# Altium schematic sheet X13-Isolation.SchDoc
size A4; SheetNumber: 24
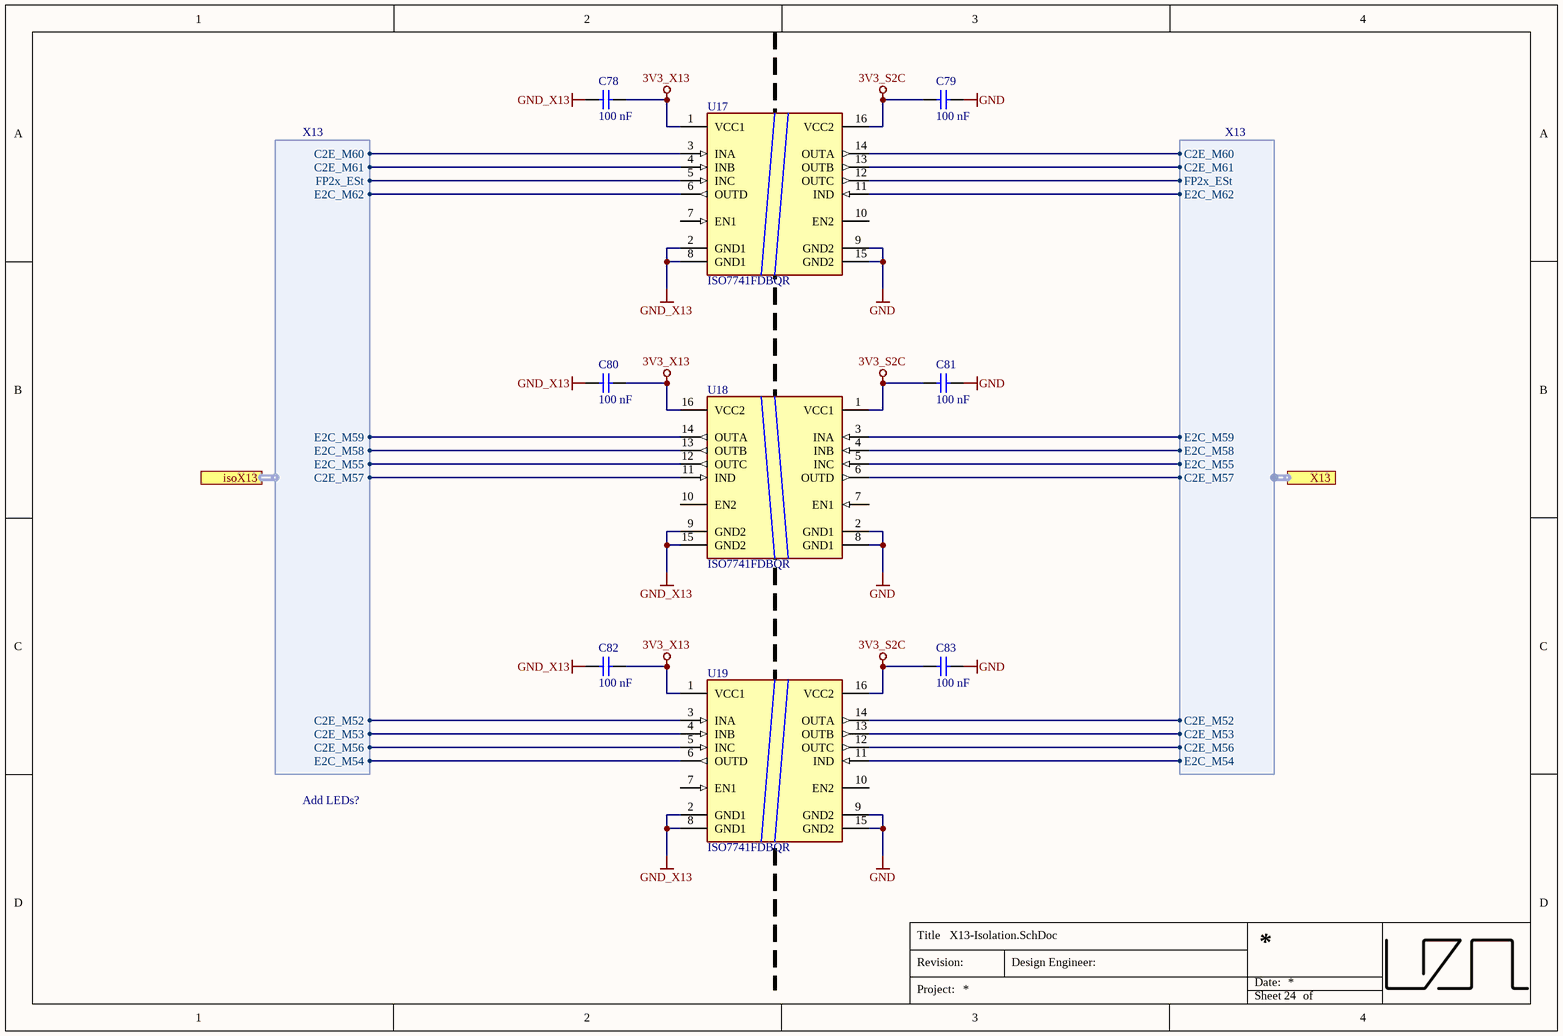
[diagram p0: X13-Isolation.SchDoc]

## Parts
C78  100 nF  [C_0603_TE]
C79  100 nF  [C_0603_TE]
C80  100 nF  [C_0603_TE]
C81  100 nF  [C_0603_TE]
C82  100 nF  [C_0603_TE]
C83  100 nF  [C_0603_TE]
U17  ISO7741FDBQR  [SOP64P600X175-16N]
U18  ISO7741FDBQR  [SOP64P600X175-16N]
U19  ISO7741FDBQR  [SOP64P600X175-16N]

## Ports
isoX13 (harness X13), X13 (harness X13)

## Harnesses
X13: C2E_M52, C2E_M53, C2E_M56, C2E_M57, C2E_M60, C2E_M61, E2C_M54, E2C_M55, E2C_M58, E2C_M59, E2C_M62, FP2x_ESt

## Nets
3V3_S2C: C79.2 C81.2 C83.2 U17.16(VCC2) U18.1(VCC1) U19.16(VCC2)
3V3_X13: C78.1 C80.1 C82.1 U17.1(VCC1) U18.16(VCC2) U19.1(VCC1)
GND: C79.1 C81.1 C83.1 U17.9(GND2) U17.15(GND2) U18.2(GND1) U18.8(GND1) U19.9(GND2) U19.15(GND2)
GND_X13: C78.2 C80.2 C82.2 U17.2(GND1) U17.8(GND1) U18.9(GND2) U18.15(GND2) U19.2(GND1) U19.8(GND1)
NetU17_3: U17.3(INA) ; port isoX13.C2E_M60
NetU17_4: U17.4(INB) ; port isoX13.C2E_M61
NetU17_5: U17.5(INC) ; port isoX13.FP2x_ESt
NetU17_6: U17.6(OUTD) ; port isoX13.E2C_M62
NetU17_11: U17.11(IND) ; port X13.E2C_M62
NetU17_12: U17.12(OUTC) ; port X13.FP2x_ESt
NetU17_13: U17.13(OUTB) ; port X13.C2E_M61
NetU17_14: U17.14(OUTA) ; port X13.C2E_M60
NetU18_3: U18.3(INA) ; port X13.E2C_M59
NetU18_4: U18.4(INB) ; port X13.E2C_M58
NetU18_5: U18.5(INC) ; port X13.E2C_M55
NetU18_6: U18.6(OUTD) ; port X13.C2E_M57
NetU18_11: U18.11(IND) ; port isoX13.C2E_M57
NetU18_12: U18.12(OUTC) ; port isoX13.E2C_M55
NetU18_13: U18.13(OUTB) ; port isoX13.E2C_M58
NetU18_14: U18.14(OUTA) ; port isoX13.E2C_M59
NetU19_3: U19.3(INA) ; port isoX13.C2E_M52
NetU19_4: U19.4(INB) ; port isoX13.C2E_M53
NetU19_5: U19.5(INC) ; port isoX13.C2E_M56
NetU19_6: U19.6(OUTD) ; port isoX13.E2C_M54
NetU19_11: U19.11(IND) ; port X13.E2C_M54
NetU19_12: U19.12(OUTC) ; port X13.C2E_M56
NetU19_13: U19.13(OUTB) ; port X13.C2E_M53
NetU19_14: U19.14(OUTA) ; port X13.C2E_M52

Not connected (* = marked no-connect by the designer): U17 7(EN1) 10(EN2); U18 7(EN1) 10(EN2); U19 7(EN1) 10(EN2)

## Notes on the sheet
- Add LEDs?
- Title
- Revision:
- Design Engineer:
- Date:
- Project:
- Sheet
- of

## Library data of the parts
C78-C83 = UZgen_C_0603_100nF_50V_X7R: Generic capacitor; Manufacturer: UZgen; Voltage: 50V; Tolerance: 10 %; Created from: AGeiger; Manufacturer Part Number: UZgen_C_0603_100nF_50V_X7R; PartID: 1; Created On: 02/07/2024 14:42:23; Value: 100 nF; Device Package: 0603; Technology: X7R; Mounting Type: SMD; Last Updated: 08/08/2024 15:01:15
U17-U19 = ISO7741FDBQR: ISO774xT-Q1 High-Speed, Reinforced Quad-Channel Digital Isolators With Integrated; Manufacturer: Texas Instruments; Created from: FRosner; Manufacturer Part Number: ISO7741FDBQR; PartID: 9; Created On: 23/02/2025 18:08:33; ComponentLink1Description: Datasheet; ComponentLink1URL: https://www.ti.com/lit/ds/symlink/iso7741.pdf; Component Type: Digital Isolator; Device Package: SSOP-16; Last Updated: 26/03/2025 16:07:30; Mounting Type: SMD; Operating Temperature: -55 to +125 °C; Series: ISO7741; Supplier 1: Mouser; Supplier Part Number 1: 595-ISO7741FDBQR; Supplier 2: LCSC; Supplier Part Number 2: C2872241; Type: Digital Isolator; Value: ISO7741FDBQR; LCSC Part Number: C2872241